# EasyEDA schematic SCH_ECD_Project_Group_08_2025-03-04.json
TITLE: Sheet_1; REV: 1.0; Date: 2025-03-04; Sheet: 1/1; Drawn By: don_; Company: Your Company
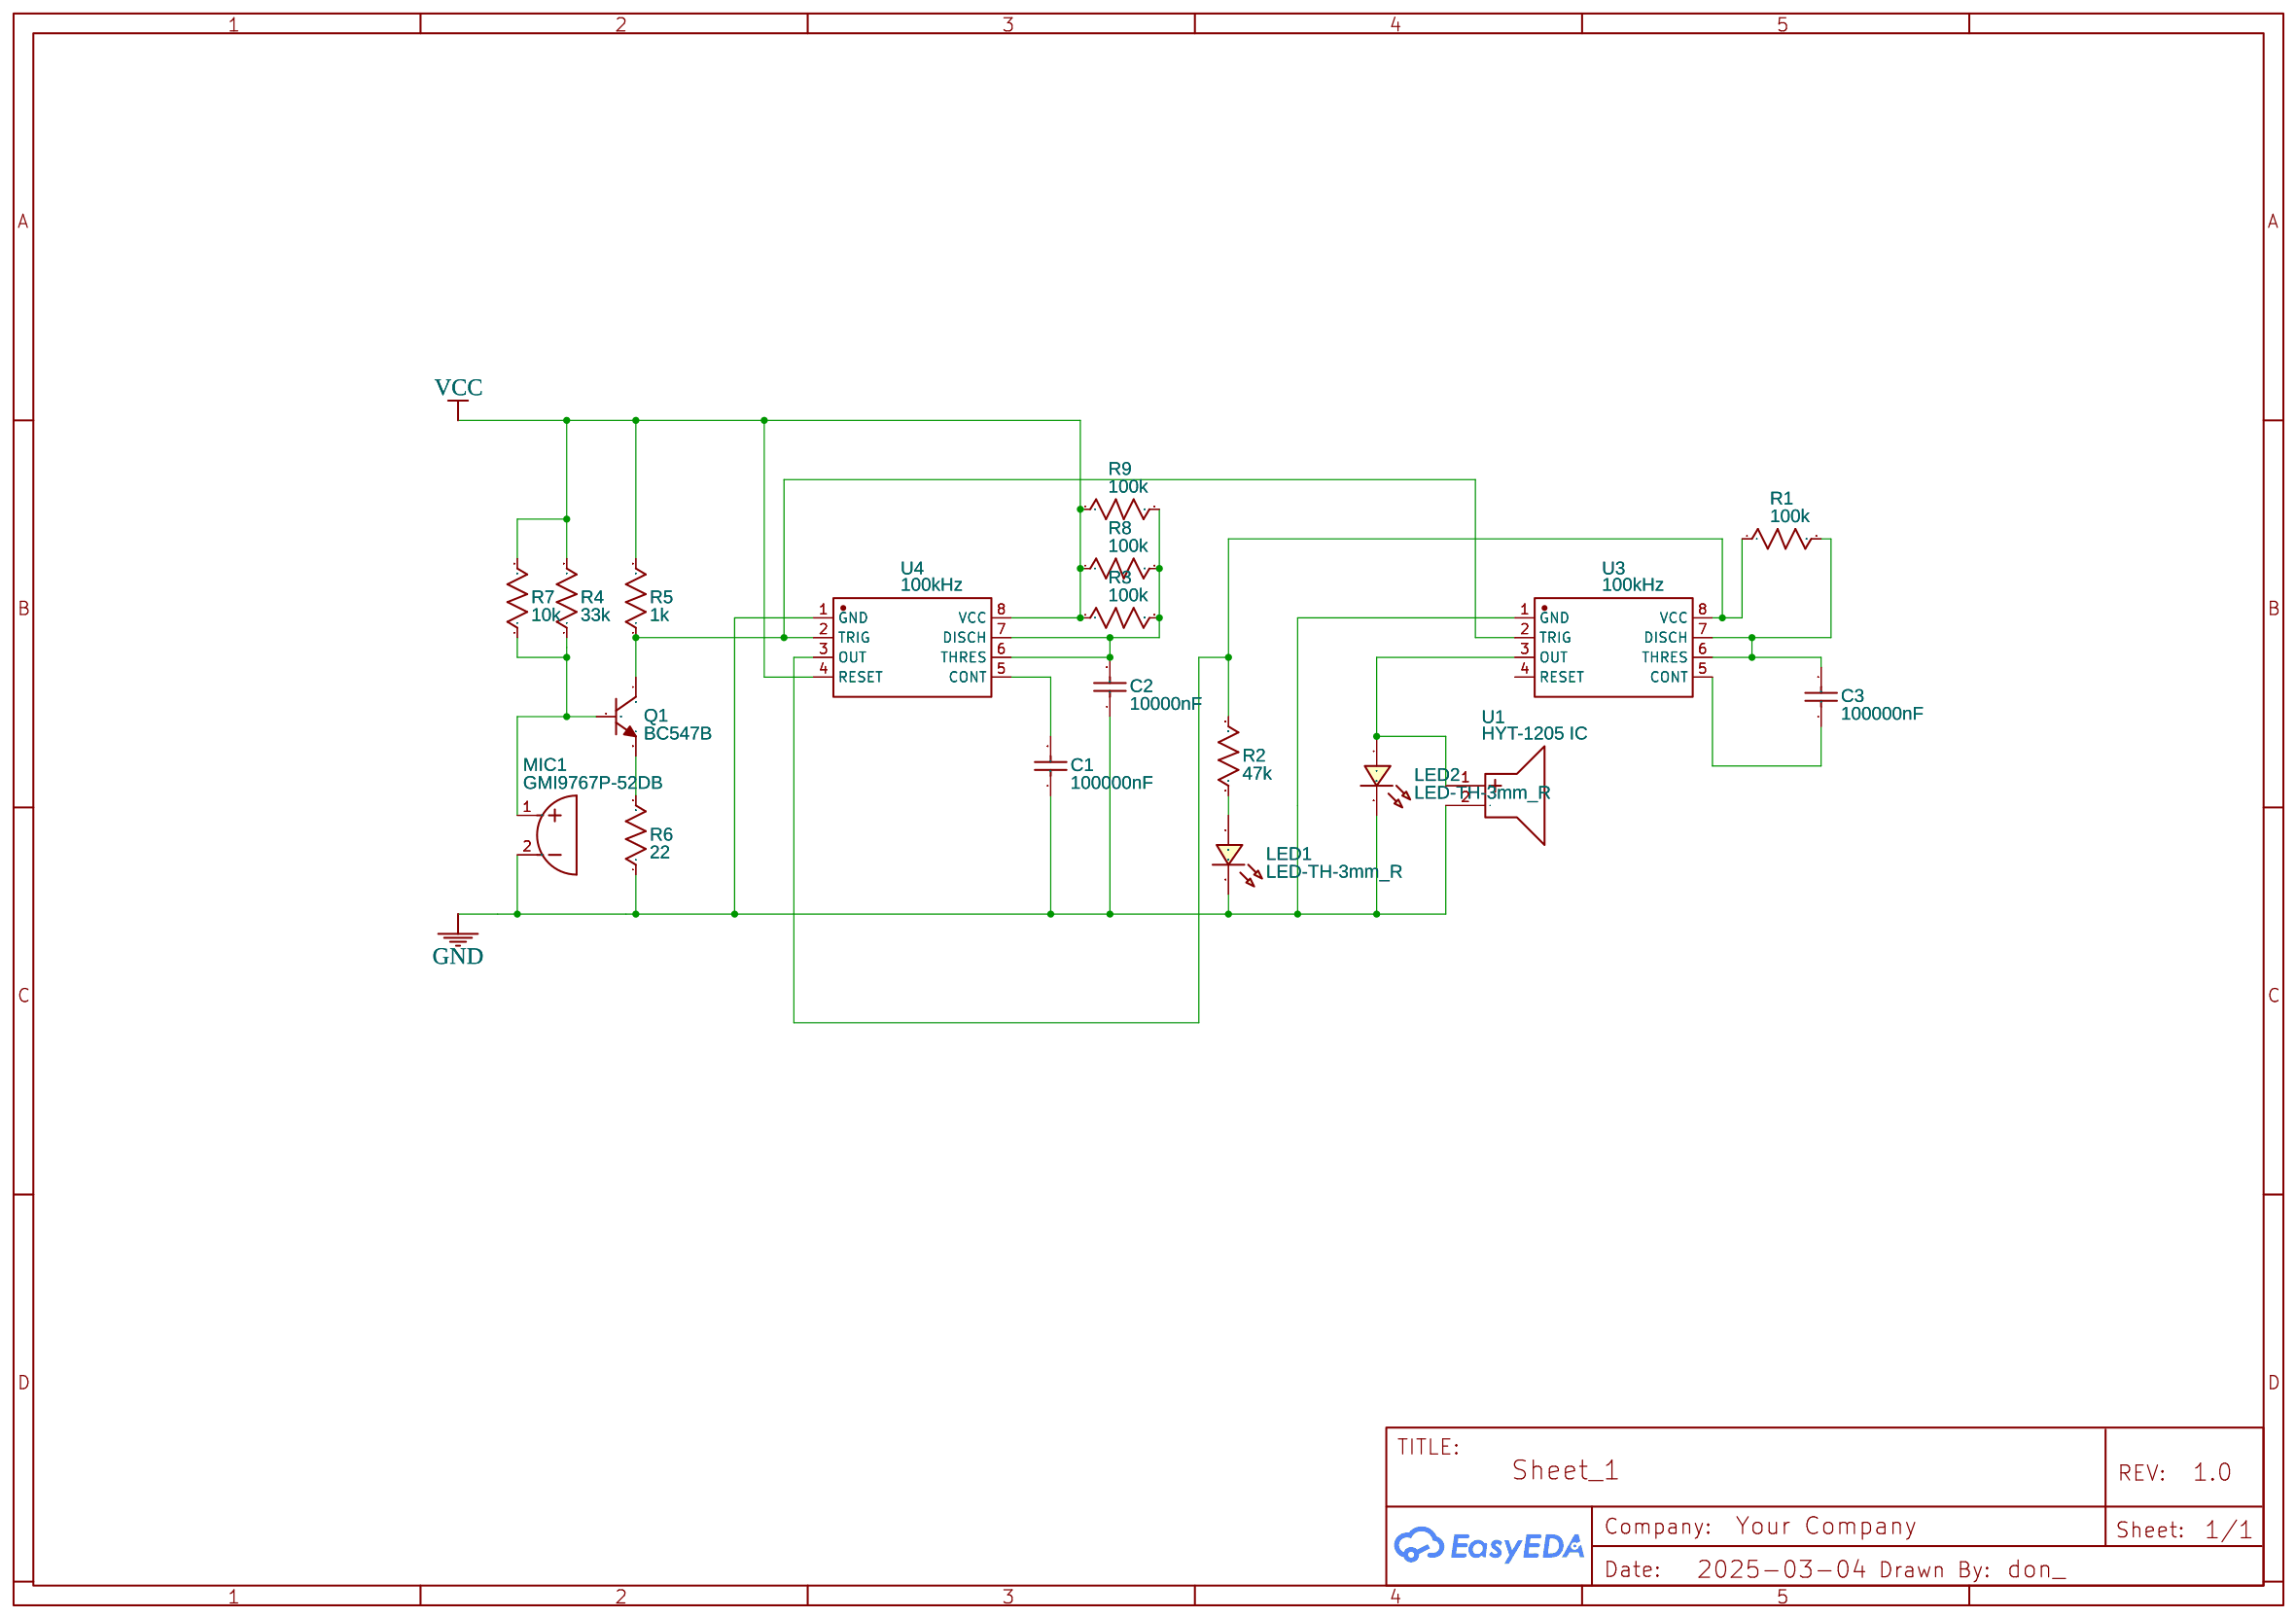
[diagram p0: schematic sheet]

## Parts
C1  100000nF  [CAP-TH_L6.5-W4.0-P5.00-D1.0]
C2  10000nF  [CAP-TH_L6.5-W4.0-P5.00-D1.0]
C3  100000nF  [CAP-TH_L6.5-W4.0-P5.00-D1.0]
LED1  LED-TH-3mm_R  [LED-TH_BD3.0_RED]
LED2  LED-TH-3mm_R  [LED-TH_BD3.0_RED]
MIC1  GMI9767P-52DB  [MIC-TH_BD9.7-P2.54-D0.8-L-FD]
Q1  BC547B  [TO-92-3_L4.9-W3.7-P1.27-L]
R1  100k  [R_AXIAL-0.4]
R2  47k  [R_AXIAL-0.4]
R3  100k  [R_AXIAL-0.4]
R4  33k  [R_AXIAL-0.4]
R5  1k  [R_AXIAL-0.4]
R6  22  [R_AXIAL-0.4]
R7  10k  [R_AXIAL-0.4]
R8  100k  [R_AXIAL-0.4]
R9  100k  [R_AXIAL-0.4]
U1  HYT-1205 IC  [BUZ-TH_BD12.0-P7.60-D0.6-FD]
U3  100kHz  [PDIP-8_L9.5-W6.4-P2.54-LS7.6-BL]
U4  100kHz  [PDIP-8_L9.5-W6.4-P2.54-LS7.6-BL]

## Library data of the parts
C1-C3 = CAPACITOR15NF100V: Contributor: LCSC; Supplier: LCSC; Manufacturer: null; Manufacturer Part: 电容15nf100v; Supplier Part: C26191; JLCPCB Part Class: Extended Part
LED1 LED2 = LED-TH-3mm_R: Manufacturer: EVERLIGHT(台湾亿光); Manufacturer Part: 204-10SDRD/S530-A3-L; Supplier Part: C84774; Supplier: LCSC; Contributor: LCEDA_Lib
MIC1 = GMI9767P-52DB: Contributor: LCSC; Supplier: LCSC; Supplier Part: C234023; Manufacturer: INGHAi(赢海); JLCPCB Part Class: Extended Part
Q1 = BC547B: Contributor: LCSC; Supplier: LCSC; Supplier Part: C713613; Manufacturer: LGE(鲁光); JLCPCB Part Class: Extended Part
R1-R9 = R_AXIAL-0.4_US: Contributor: LCEDA_Lib
U1 = HYT-1205 IC: Supplier: LCSC; Supplier Part: C7544833; Manufacturer: HYDZ(华宇); Contributor: lcsc; JLCPCB Part Class: Extended Part
U3 U4 = NA555P: Contributor: LCSC; Supplier: LCSC; Supplier Part: C1520193; Manufacturer: TI(德州仪器); JLCPCB Part Class: Extended Part

## Nets
GND: C1.1 C2.1 LED1.2 LED2.2 MIC1.2 R6.1 U1.2(-) U3.1(GND) U4.1(GND)
VCC: R3.1 R4.2 R5.2 R7.2 R8.1 R9.1 U4.4(RESET) U4.8(VCC)
Net-(C1-2): C1.2 U4.5(CONT)
Net-(C2-2): C2.2 R3.2 R8.2 R9.2 U4.6(THRES) U4.7(DISCH)
Net-(C3-1): C3.1 U3.5(CONT)
Net-(C3-2): C3.2 R1.2 U3.6(THRES) U3.7(DISCH)
Net-(LED1-1): LED1.1 R2.1
Net-(LED2-1): LED2.1 U1.1(+) U3.3(OUT)
Net-(MIC1-1): MIC1.1 Q1.2(B) R4.1 R7.1
Net-(Q1-1): Q1.1(C) R5.1 U3.2(TRIG) U4.2(TRIG)
Net-(Q1-3): Q1.3(E) R6.2
Net-(R1-1): R1.1 R2.2 U3.8(VCC) U4.3(OUT)

Not connected (* = marked no-connect by the designer): U3 4(RESET)
